# EAGLE design Spring12_6_Node (EAGLE 6.1)
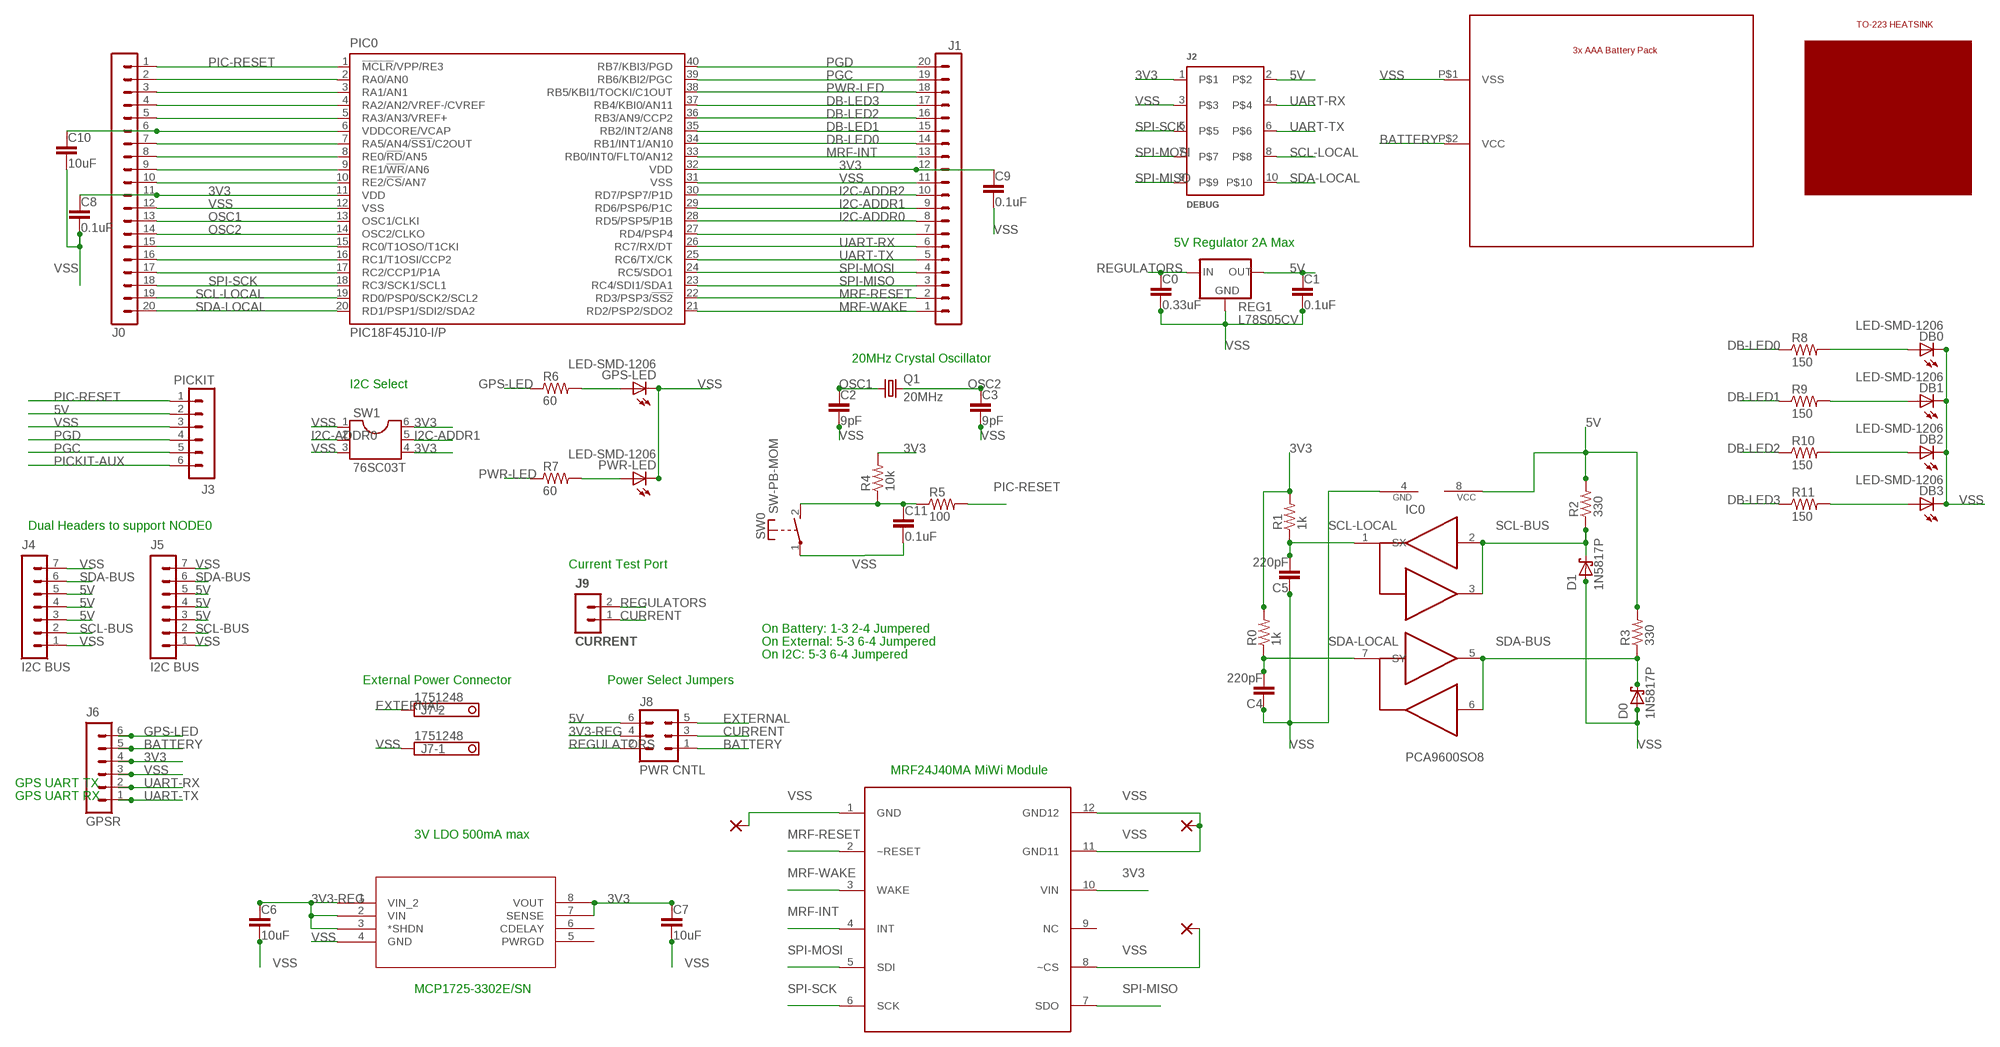
[diagram p0: schematic, sheet 1]

## Parts
BATT0  2479-BATTERY  [2479-BATTERY]
C0  0.33uF  C2.5-5  [C2.5-5]
C1  0.1uF  C2.5-5  [C2.5-5]
C2  9pF  C2.5-5  [C2.5-5]
C3  9pF  C2.5-5  [C2.5-5]
C4  220pF  C2.5-5  [C2.5-5]
C5  220pF  C2.5-5  [C2.5-5]
C6  10uF  C2.5-5  [C2.5-5]
C7  10uF  C2.5-5  [C2.5-5]
C8  0.1uF  C2.5-5  [C2.5-5]
C9  0.1uF  C2.5-5  [C2.5-5]
C10  10uF  C2.5-5  [C2.5-5]
C11  0.1uF  C2.5-5  [C2.5-5]
D0  1N5817P  [1N5817]
D1  1N5817P  [1N5817]
DB0  LED-SMD-1206  [LED1206]
DB1  LED-SMD-1206  [LED1206]
DB2  LED-SMD-1206  [LED1206]
DB3  LED-SMD-1206  [LED1206]
GPS-LED  LED-SMD-1206  [LED1206]
IC0  PCA9600SO8  [SO08]
J0  MA20-1  [MA20-1]
J1  MA20-1  [MA20-1]
J2  DEBUG  2510-6002  [2510-6002]
J3  PICKIT  MA06-1  [MA06-1]
J4  I2C BUS  MA07-1  [MA07-1]
J5  I2C BUS  MA07-1  [MA07-1]
J6  GPSR  MA06-1  [MA06-1]
J7  1751248  [1751248]
J8  PWR CNTL  MA03-2  [MA03-2]
J9  CURRENT  MA02-1  [MA02-1]
PIC0  PIC18F45J10-I/P  [DIL40]
PWR-LED  LED-SMD-1206  [LED1206]
Q1  20MHz  CRYSTALHC49U-V  [HC49U-V]
R0  1k  R-1/4W  [R-1/4W]
R1  1k  R-1/4W  [R-1/4W]
R2  330  R-1/4W  [R-1/4W]
R3  330  R-1/4W  [R-1/4W]
R4  10k  R1206  [R1206]
R5  100  R1206  [R1206]
R6  60  R1206  [R1206]
R7  60  R1206  [R1206]
R8  150  R1206  [R1206]
R9  150  R1206  [R1206]
R10  150  R1206  [R1206]
R11  150  R1206  [R1206]
REG0  MCP1725-XXXXX/SN  [SOIC8-N_MC]
REG1  L78S05CV  78XXL  [78XXL]
RF0  MRF24J40MA  [PCB12]
SW0  SW-PB-MOM  [SW-MOM-PB]
SW1  76SC03T  DIL6  [DIL06]
U$18  VIA  [VIA]
U$19  VIA  [VIA]
U$20  VIA  [VIA]
U$28  7-361-BA  [7-361-BA]

## Nets
3V3: C7.1 C8.1 C9.1 J0.11 J1.12 J2.1 J6.4 PIC0.11(VDD) PIC0.32(VDD) R0.2 R1.2 R4.2 REG0.7(SENSE) REG0.8(VOUT) RF0.10(VIN) SW1.4 SW1.6
3V3-REG: C6.1 J8.4 REG0.1(VIN_2) REG0.2(VIN) REG0.3(*SHDN)
5V: C1.1 IC0.8(VCC) J2.2 J3.2 J4.3 J4.4 J4.5 J5.3 J5.4 J5.5 J8.6 R2.2 R3.2 REG1.OUT
BATTERY: BATT0.P$2(VCC) J6.5 J8.1
CURRENT: J8.3 J9.1
DB-LED0: J1.14 PIC0.34(RB1/INT1/AN10) R8.1
DB-LED1: J1.15 PIC0.35(RB2/INT2/AN8) R9.1
DB-LED2: J1.16 PIC0.36(RB3/AN9/CCP2) R10.1
DB-LED3: J1.17 PIC0.37(RB4/KBI0/AN11) R11.1
EXTERNAL: J7.2 J8.5
GPS-LED: J6.6 R6.1
I2C-ADDR0: J1.8 PIC0.28(RD5/PSP5/P1B) SW1.2
I2C-ADDR1: J1.9 PIC0.29(RD6/PSP6/P1C) SW1.5
I2C-ADDR2: J1.10 PIC0.30(RD7/PSP7/P1D)
MRF-INT: J1.13 PIC0.33(RB0/INT0/FLT0/AN12) RF0.4(INT)
MRF-RESET: J1.2 PIC0.22(RD3/PSP3/!SS2!) RF0.2(~RESET)
MRF-WAKE: J1.1 PIC0.21(RD2/PSP2/SDO2) RF0.3(WAKE)
N$1: J0.8 PIC0.8(RE0/!RD!/AN5)
N$2: J0.15 PIC0.15(RC0/T1OSO/T1CKI)
N$3: J0.16 PIC0.16(RC1/T1OSI/CCP2)
N$4: GPS-LED.A R6.2
N$5: PWR-LED.A R7.2
N$6: C11.1 R4.1 R5.1 SW0.2(S)
N$7: DB0.A R8.2
N$8: J1.7 PIC0.27(RD4/PSP4)
N$9: DB1.A R9.2
N$10: DB2.A R10.2
N$11: DB3.A R11.2
N$13: J0.2 PIC0.2(RA0/AN0)
N$14: J0.3 PIC0.3(RA1/AN1)
N$15: J0.4 PIC0.4(RA2/AN2/VREF-/CVREF)
N$16: J0.5 PIC0.5(RA3/AN3/VREF+)
N$17: C10.1 J0.6 PIC0.6(VDDCORE/VCAP)
N$18: J0.7 PIC0.7(RA5/AN4/!SS1!/C2OUT)
N$20: J0.9 PIC0.9(RE1/!WR!/AN6)
N$21: J0.10 PIC0.10(RE2/!CS!/AN7)
N$26: J0.17 PIC0.17(RC2/CCP1/P1A)
OSC1: C2.1 J0.13 PIC0.13(OSC1/CLKI) Q1.1
OSC2: C3.1 J0.14 PIC0.14(OSC2/CLKO) Q1.2
PGC: J1.19 J3.5 PIC0.39(RB6/KBI2/PGC)
PGD: J1.20 J3.4 PIC0.40(RB7/KBI3/PGD)
PIC-RESET: J0.1 J3.1 PIC0.1(!MCLR!/VPP/RE3) R5.2
PICKIT-AUX: J3.6
PWR-LED: J1.18 PIC0.38(RB5/KBI1/TOCKI/C1OUT) R7.1
REGULATORS: C0.1 J8.2 J9.2 REG1.IN
SCL-BUS: D1.C IC0.2(RX) IC0.3(TX) J4.2 J5.2 R2.1
SCL-LOCAL: C5.2 IC0.1(SX) J0.19 J2.8 PIC0.19(RD0/PSP0/SCK2/SCL2) R1.1
SDA-BUS: D0.C IC0.5(TY) IC0.6(RY) J4.6 J5.6 R3.1
SDA-LOCAL: C4.2 IC0.7(SY) J0.20 J2.10 PIC0.20(RD1/PSP1/SDI2/SDA2) R0.1
SPI-MISO: J1.3 J2.9 PIC0.23(RC4/SDI1/SDA1) RF0.7(SDO)
SPI-MOSI: J1.4 J2.7 PIC0.24(RC5/SDO1) RF0.5(SDI)
SPI-SCK: J0.18 J2.5 PIC0.18(RC3/SCK1/SCL1) RF0.6(SCK)
UART-RX: J1.6 J2.4 J6.2 PIC0.26(RC7/RX/DT)
UART-TX: J1.5 J2.6 J6.1 PIC0.25(RC6/TX/CK)
VSS: BATT0.P$1(VSS) C0.2 C1.2 C2.2 C3.2 C4.1 C5.1 C6.2 C7.2 C8.2 C9.2 C10.2 C11.2 D0.A D1.A DB0.C DB1.C DB2.C DB3.C GPS-LED.C IC0.4(GND) J0.12 J1.11 J2.3 J3.3 J4.1 J4.7 J5.1 J5.7 J6.3 J7.1 PIC0.12(VSS) PIC0.31(VSS) PWR-LED.C REG0.4(GND) REG1.GND RF0.1(GND) RF0.8(~CS) RF0.11(GND11) RF0.12(GND12) SW0.1(P) SW1.1 SW1.3 U$18.1(P) U$19.1(P) U$20.1(P)
Unconnected: REG0.5(PWRGD) REG0.6(CDELAY) RF0.9(NC)

## Notes on the sheet
- 5V Regulator 2A Max
- 20MHz Crystal Oscillator
- I2C Select
- Dual Headers to support NODE0
- Current Test Port
- On Battery: 1-3 2-4 Jumpered
- On External: 5-3 6-4 Jumpered
- On I2C: 5-3 6-4 Jumpered
- External Power Connector | Power Select Jumpers
- MRF24J40MA MiWi Module
- GPS UART TX
- GPS UART RX
- 3V LDO 500mA max
- MCP1725-3302E/SN

## Library data of the parts
BATT0 = 4534_Node_Board:2479-BATTERY
C0 C1 C3-C7 = 4534_I2C2:C2.5-5: CAPACITOR, 2.5 MM SPACING
C2 C8-C11 = 4534_I2C2:C2.5-5: CAPACITOR, 2.5 MM SPACING; DIGIKEY: 490-3632-ND
D0 D1 = 4534_I2C2:1N5817: Schottky diode
DB0 DB1-DB3 GPS-LED PWR-LED = 4534_I2C2:LED-SMD-1206: 160-1169-1-ND
IC0 = 4534_I2C2:PCA9600: I2C ACTIVE TERMINATOR SO-8
J0 J1 = con-lstb:MA20-1: PIN HEADER; OC_FARNELL: unknown; OC_NEWARK: unknown
J2 = 4534_I2C2:2510-6002: 3M 2510-6002 Walled Header
J3 J6 = 4534:MA06-1: Male Header 0.040 drill
J4 J5 = 4534_I2C2:MA07-1: Male Header 0.040 drill
J7 = con-phoenix-350:1751248: MKDS 1/ 2-3,5 Printklemme Nennstrom: 10 A Bemessungsspannung: 160 V Raster: 3,5 mm Polzahl: 2 Montageart: Löten Anschlussart: Schraubanschluss Anschlussrichtung vom Leiter zur Platine: 0° Source: http://eshop.phoenixcontact.com .. 1751248.pdf; OC_FARNELL: unknown; OC_NEWARK: unknown
J8 = con-lstb:MA03-2: PIN HEADER; OC_FARNELL: unknown; OC_NEWARK: unknown
J9 = 4534_I2C2:MA02-1: Male Header 0.040 drill
PIC0 = 4534:PIC18F45J10: 40 PIN DIP PIC W/2 MSSP
Q1 = crystal:CRYSTAL: CRYSTAL; DIGIKEY: XC1723-ND; OC_FARNELL: 1666969; OC_NEWARK: unknown
R0 R1-R3 = 4534_I2C2:R-1/4W: STANDARD 1/4W 5% RESISTOR
R4-R11 = 4534_I2C2:R1206: Surface mount resistor, 1206 package
REG0 = 4534_Node_Board:MCP1725-XXXXX/SN; NEWARK: MCP1725-3002E/SN
REG1 = v-reg:78XXL: VOLTAGE REGULATOR
RF0 = 4534_Node_Board:MRF24J40MA
SW0 = 4534:SW-PB-MOM: Digi-Key P13589S-ND
SW1 = ic-package:DIL6: Dual In Line / Socket
U$18-U$20 = 4534_I2C2:VIA: connect top of board to bottom of board through a via
U$28 = 4534_Node_Board:7-361-BA

## Board
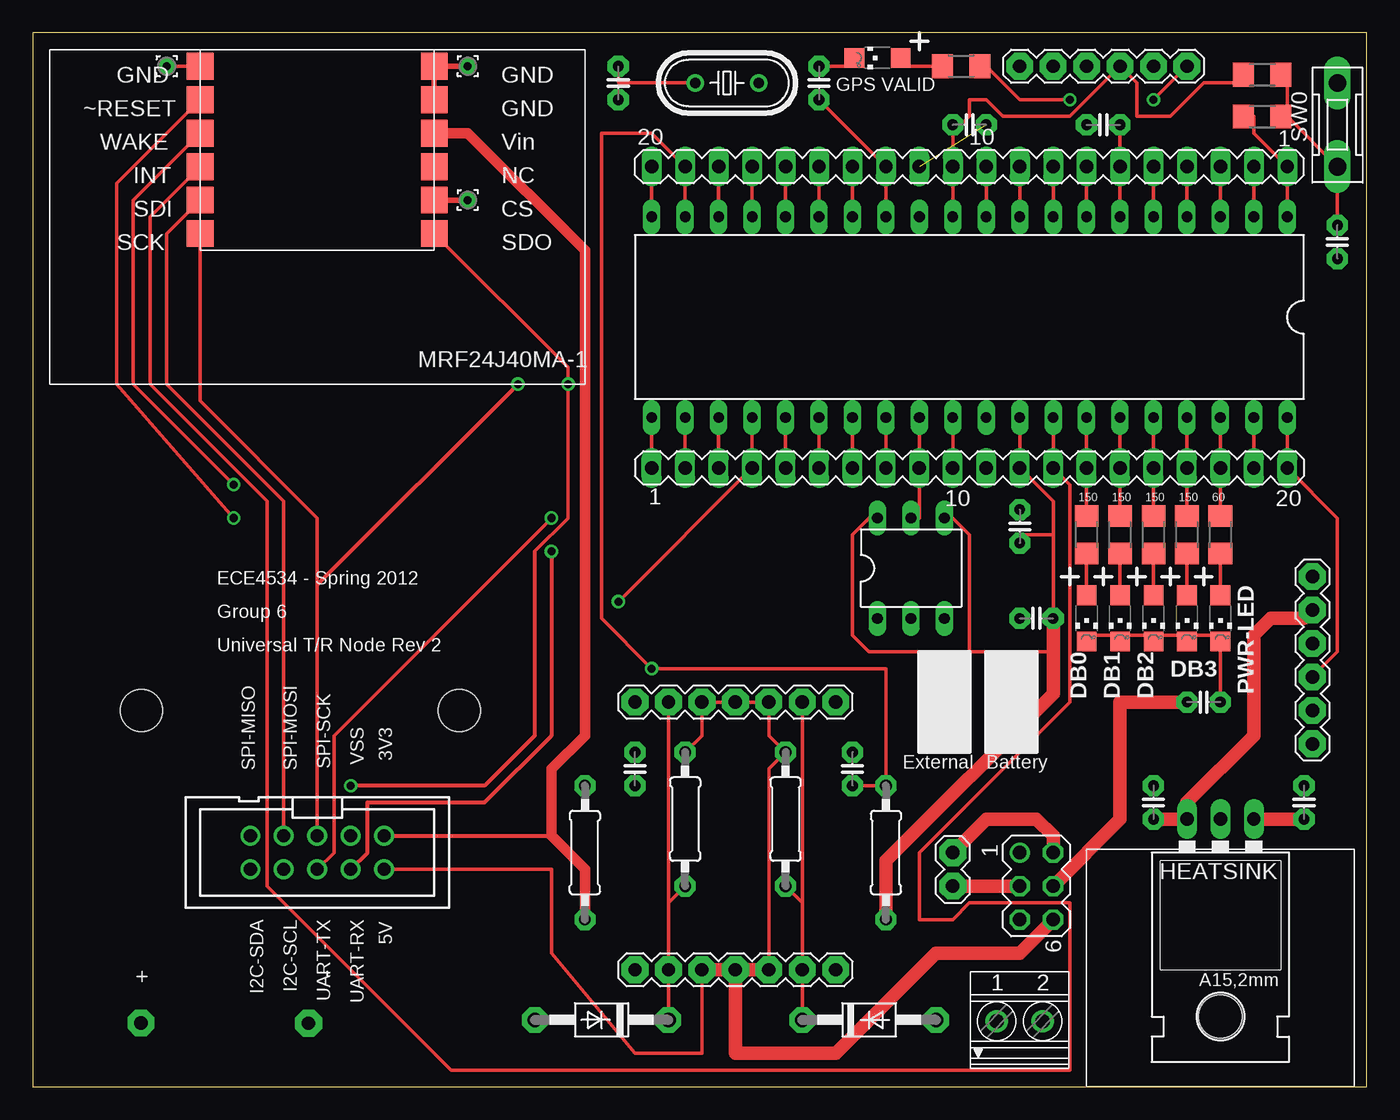
[diagram p1: board, top side]
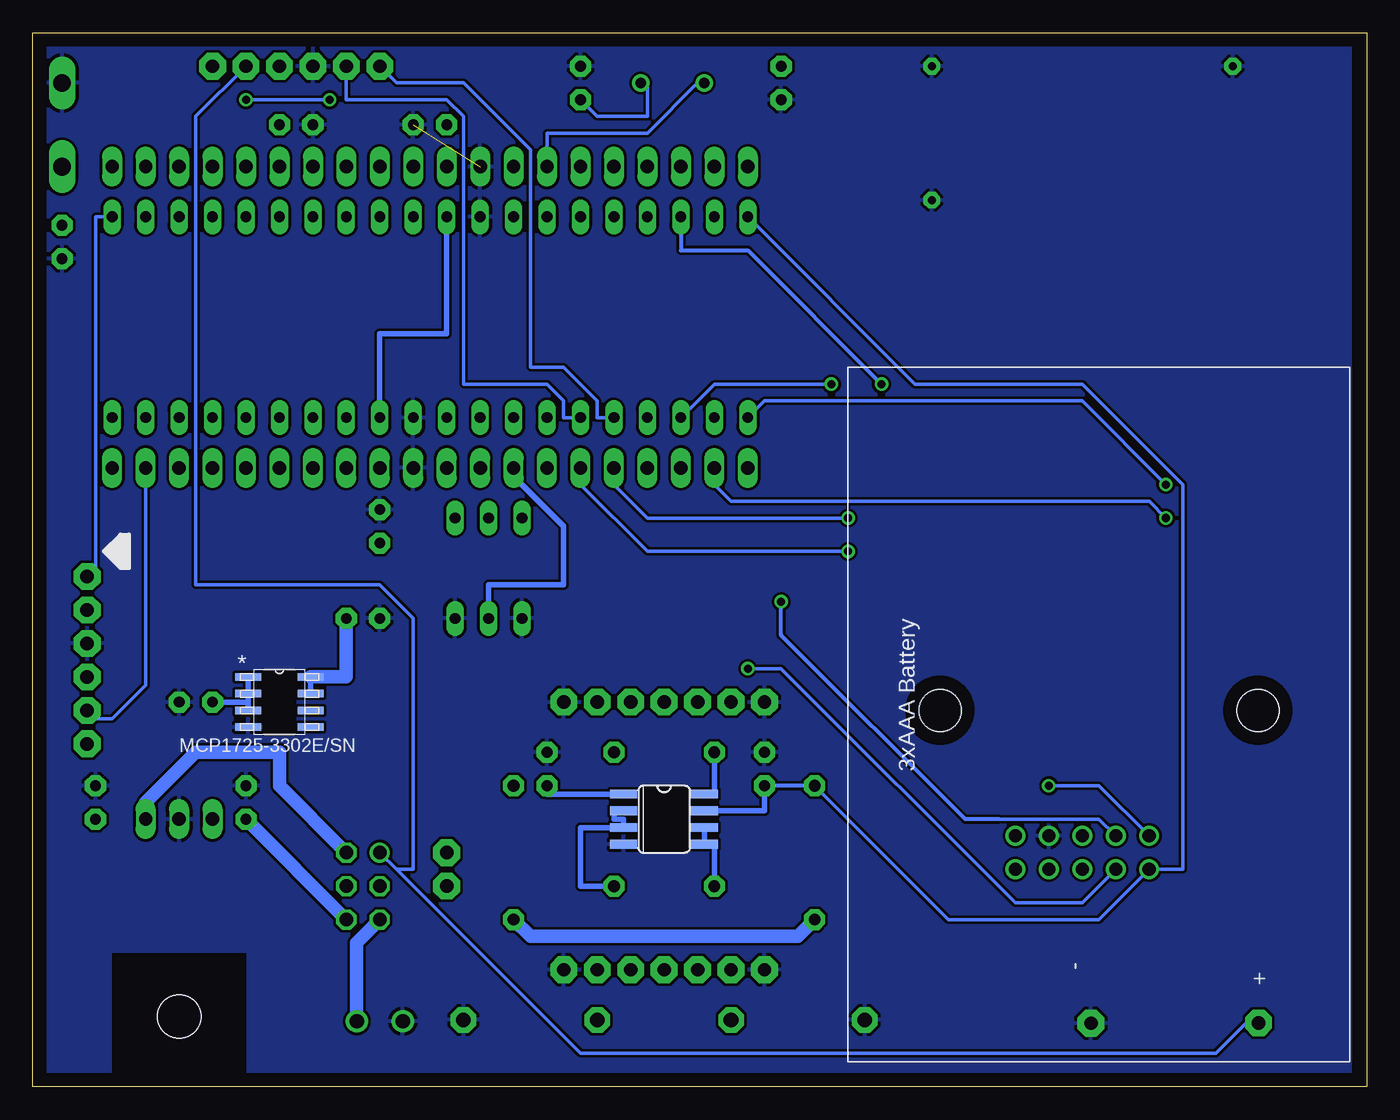
[diagram p2: board, bottom side, seen from below]

Size 101.27 x 80 mm. Coordinates in mm from the lower left corner, seen from the top.
Outline: 0,0 101.27,0 101.27,80 0,80 0,0
Copper layers (1*16): Top 0.035mm / dielectric 1.5mm / Bottom 0.035mm
Design rules: minimum track width 10mil, minimum drill 24mil, track to track 8mil, track to pad 8mil, pad to pad 8mil, via to via 8mil, smd to smd 8mil, copper to edge 40mil, drill to drill 8mil, minimum pad ring 10mil, minimum via ring 8mil, stop-mask expansion 4mil, vias tented up to drill 0mil, thermal gap 10mil
tRestrict: area 17.8,76.2 to 25.4,80; area 44.5,52.1 to 97.8,64.8; area 80,0 to 100.3,17.8; area 51.4,73.7 to 54,78.7; area 62.9,36.8 to 70.5,41.9; area 14,63.5 to 29.2,78.7
bRestrict: area 81.3,26.7 to 83.8,31.8; area 85.1,1.3 to 95.2,10.2; area 51.4,17.8 to 55.2,22.9
vRestrict: area 1.3,54.6 to 41.9,80; area 48.3,16.5 to 50.8,24.1; area 40.6,14 to 43.2,21.6; area 39.4,3.8 to 47,6.4; area 59.7,3.8 to 67.3,6.3; area 63.5,14 to 66,21.6; area 55.9,16.5 to 58.4,24.1; area 11.4,14 to 31.8,21.6

### Footprints (pad centres in the part's own frame; a part is rotated, then mirrored left to right if it is on the bottom)
2479-BATTERY = drill 1.016 pad 2.032 octagon: P$1 24.384,-7.01; P$2 24.359,-19.736 | hole 3.2: 0.635,4.445; 0.635,-19.685
C2.5-5 = drill 0.813 pad 1.6 octagon: 1 -1.27,0; 2 1.27,0
1N5817 = drill 1.118 pad 1.93 octagon: A 5.08,0; C -5.08,0
LED1206 = smd 1.5 x 1.5: A 0,-1.75; C 0,1.75
SO08 = smd 0.66 x 2.032: 1 -1.905,-3.073; 2 -0.635,-3.073; 3 0.635,-3.073; 4 1.905,-3.073; 5 1.905,3.073; 6 0.635,3.073; 7 -0.635,3.073; 8 -1.905,3.073
MA20-1 = drill 1.016 long: 1 -24.13,0; 2 -21.59,0; 3 -19.05,0; 4 -16.51,0; 5 -13.97,0; 6 -11.43,0; 7 -8.89,0; 8 -6.35,0; 9 -3.81,0; 10 -1.27,0; 11 1.27,0; 12 3.81,0; 13 6.35,0; 14 8.89,0; 15 11.43,0; 16 13.97,0; 17 16.51,0; 18 19.05,0; 19 21.59,0; 20 24.13,0
2510-6002 = drill 1 pad 1.422: 1 -5.08,-1.27; 2 -5.08,1.27; 3 -2.54,-1.27; 4 -2.54,1.27; 5 0,-1.27; 6 0,1.27; 7 2.54,-1.27; 8 2.54,1.27; 9 5.08,-1.27; 10 5.08,1.27
MA06-1 = drill 1.016 pad 2.032 octagon: 1 -6.35,0; 2 -3.81,0; 3 -1.27,0; 4 1.27,0; 5 3.81,0; 6 6.35,0
MA07-1 = drill 1.016 pad 2.032 octagon: 1 -7.62,0; 2 -5.08,0; 3 -2.54,0; 4 0,0; 5 2.54,0; 6 5.08,0; 7 7.62,0
1751248 = drill 1.1 pad 1.7: 1 -1.75,-0.1; 2 1.75,-0.1
MA03-2 = drill 1.016: 1 -2.54,-1.27 | drill 1.016 octagon: 2 -2.54,1.27; 3 0,-1.27; 4 0,1.27; 5 2.54,-1.27; 6 2.54,1.27
MA02-1 = drill 1.016 pad 2.032 octagon: 1 -1.27,0; 2 1.27,0
DIL40 = drill 0.813 long: 1 -24.13,-7.62; 2 -21.59,-7.62; 3 -19.05,-7.62; 4 -16.51,-7.62; 5 -13.97,-7.62; 6 -11.43,-7.62; 7 -8.89,-7.62; 8 -6.35,-7.62; 9 -3.81,-7.62; 10 -1.27,-7.62; 11 1.27,-7.62; 12 3.81,-7.62; 13 6.35,-7.62; 14 8.89,-7.62; 15 11.43,-7.62; 16 13.97,-7.62; 17 16.51,-7.62; 18 19.05,-7.62; 19 21.59,-7.62; 20 24.13,-7.62; 21 24.13,7.62; 22 21.59,7.62; 23 19.05,7.62; 24 16.51,7.62; 25 13.97,7.62; 26 11.43,7.62; 27 8.89,7.62; 28 6.35,7.62; 29 3.81,7.62; 30 1.27,7.62; 31 -1.27,7.62; 32 -3.81,7.62; 33 -6.35,7.62; 34 -8.89,7.62; 35 -11.43,7.62; 36 -13.97,7.62; 37 -16.51,7.62; 38 -19.05,7.62; 39 -21.59,7.62; 40 -24.13,7.62
HC49U-V = drill 0.813: 1 -2.413,0; 2 2.413,0
R-1/4W = drill 0.9 pad 1.6 octagon: 1 -5.08,0; 2 5.08,0
R1206 = smd 1.6 x 1.803: 1 -1.422,0; 2 1.422,0
SOIC8-N_MC = smd 1.981 x 0.559: 1 -2.362,1.905; 2 -2.362,0.635; 3 -2.362,-0.635; 4 -2.362,-1.905; 5 2.362,-1.905; 6 2.362,-0.635; 7 2.362,0.635; 8 2.362,1.905
78XXL = drill 1.016 long: GND 0,-3.81; IN -2.54,-3.81; OUT 2.54,-3.81 | hole 3.302: 0,11.176
PCB12 = smd 2.032 x 2.032: 1 -8.89,8.89; 2 -8.89,6.35; 3 -8.89,3.81; 4 -8.89,1.27; 5 -8.89,-1.27; 6 -8.89,-3.81; 7 8.89,-3.81; 8 8.89,-1.27; 9 8.89,1.27; 10 8.89,3.81; 11 8.89,6.35; 12 8.89,8.89
SW-MOM-PB = drill 1.346 long: 1 0,-3.81; 2 0,2.54
DIL06 = drill 0.813 long: 1 -2.54,-3.81; 2 0,-3.81; 3 2.54,-3.81; 4 2.54,3.81; 5 0,3.81; 6 -2.54,3.81
VIA = drill 0.61 pad 1.27 octagon: 1 0,0

### Placement (x,y rotation side)
BATT0  27.94,29.21 270 top
C0  96.52,21.59 90 top
C1  85.09,21.59 90 top
C2  59.69,76.2 90 top
C3  44.45,76.2 270 top
C4  45.72,24.13 270 top
C5  62.23,24.13 270 top
C6  88.9,29.21 0 top
C7  76.2,35.56 180 top
C8  74.93,42.55 90 top
C9  71.12,73.03 0 top
C10  81.28,73.03 180 top
C11  99.06,64.14 270 top
D0  43.18,5.08 180 top
D1  63.5,5.08 0 top
DB0  80.01,35.56 180 top
DB1  82.55,35.56 180 top
DB2  85.09,35.56 180 top
DB3  87.63,35.56 180 top
GPS-LED  64.14,78.11 90 top
IC0  53.34,20.32 270 bottom
J0  71.12,69.85 180 top
J1  71.12,46.99 0 top
J2  21.59,17.78 180 top
J3  97.16,32.38 270 top
J4  53.34,29.21 180 top
J5  53.34,8.89 180 top
J6  81.28,77.47 0 top
J7  74.93,5.08 0 top
J8  76.2,15.24 270 top
J9  69.85,16.51 90 top
PIC0  71.12,58.42 180 top
PWR-LED  90.17,35.56 180 top
Q1  52.7,76.2 180 top
R0  41.91,17.78 270 top
R1  64.77,17.78 270 top
R2  57.15,20.32 90 top
R3  49.53,20.32 90 top
R4  93.34,76.83 180 top
R5  93.34,73.66 180 top
R6  70.48,77.47 180 top
R7  90.17,41.91 270 top
R8  80.01,41.91 270 top
R9  82.55,41.91 270 top
R10  85.09,41.91 270 top
R11  87.63,41.91 270 top
REG0  82.55,29.21 0 bottom
REG1  90.17,16.51 180 top
RF0  21.59,68.58 0 top
SW0  99.06,72.39 180 top
SW1  66.67,39.37 0 top
U$18  33.02,67.31 0 top
U$19  33.02,77.47 0 top
U$20  10.16,77.47 0 top
U$28  87.63,2.54 180 top

### Tracks (layer width: path | path; a pad name or v marks a point on that pad's centre or on a via)
3V3
  Top 0.254: C7.1 77.47,41.91 | 77.47,41.91 77.47,44.45 J1.12 PIC0.32 | PIC0.11 J0.11 69.85,72.39 | 77.47,33.02 71.12,33.02 | 71.12,33.02 63.5,33.02 62.23,34.29 62.23,41.91 63.5,43.18 SW1.6 | 71.12,33.02 71.12,41.91 69.85,43.18 SW1.4 | 77.47,41.91 74.93,41.91 C8.1 | 69.85,73.66 C9.1 69.85,72.39 | R4.2 91.44,76.2 88.9,76.2 86.36,73.66 83.82,73.66 83.82,76.2 J6.4 78.74,73.66 73.66,73.66 72.39,74.93 71.12,74.93 71.12,73.66 69.85,72.39
  Top 0.305: J2.1 39.37,19.05
  Top 0.813: R0.2 41.91,16.51 39.37,19.05 39.37,24.13 41.91,26.67 41.91,63.5 33.02,72.39 RF0.10
  Top 1.016: R1.2 64.77,17.14 77.47,29.84 77.47,33.02 C7.1
  Bottom 0.406: REG0.7 REG0.8 | PIC0.32 74.93,57.15 69.85,57.15 PIC0.11
  Bottom 1.016: REG0.8 77.47,31.11 C7.1 | R0.2 43.18,11.43 63.5,11.43 R1.2
3V3-REG
  Top 1.016: J8.4 82.55,20.32 82.55,29.21 C6.1
  Bottom 0.406: REG0.1 REG0.2 | REG0.2 84.91,29.21 C6.1 | REG0.3 REG0.2
5V
  Top 0.254: R3.2 50.8,26.67 J4.5 J4.4 J4.3 55.88,26.67 R2.2 55.88,24.13 J5.3 | J2.2 39.37,16.51 39.37,10.16 45.72,2.54 50.8,2.54 J5.5 | 96.52,35.56 J3.2
  Top 1.016: J8.6 74.93,10.16 68.58,10.16 60.96,2.54 53.34,2.54 J5.4 | J5.5 J5.4 | J5.4 J5.3 | C1.1 REG1.OUT 87.63,21.59 92.71,26.67 92.71,34.29 93.98,35.56 96.52,35.56
  Bottom 0.406: IC0.8 49.53,22.23 R3.2
  Bottom 1.016: J8.6 C1.1
BATTERY
  Bottom 0.254: 73.66,16.51 59.69,2.54 11.43,2.54 8.89,5.08 BATT0.P$2 | 73.66,16.51 J8.1 | J6.5 88.9,73.66 88.9,38.1 74.93,38.1 72.39,35.56 72.39,16.51 73.66,16.51
CURRENT
  Top 1.016: J9.1 J8.3
DB-LED0
  Top 0.254: PIC0.34 J1.14 R8.1 80.01,43.18
DB-LED1
  Top 0.254: PIC0.35 J1.15 R9.1 82.55,43.18
DB-LED2
  Top 0.254: PIC0.36 J1.16 R10.1 85.09,43.18
DB-LED3
  Top 0.254: PIC0.37 J1.17 R11.1 87.63,43.18
EXTERNAL
  Bottom 1.016: J7.2 76.68,10.95 J8.5
GPS-LED  (via drill 0.61)
  Top 0.254: v78.74,74.93 74.93,74.93 72.39,77.47 R6.1 | J6.6 v85.09,74.93
  Bottom 0.254: v85.09,74.93 v78.74,74.93
I2C-ADDR0
  Top 0.254: J1.8 PIC0.28
  Bottom 0.406: SW1.2 66.67,38.1 60.96,38.1 60.96,42.55 64.77,46.35 J1.8
I2C-ADDR1
  Top 0.254: PIC0.29 J1.9 67.31,43.18 SW1.5
I2C-ADDR2
  Top 0.254: J1.10 PIC0.30
MRF-INT
  Top 0.254: PIC0.33 J1.13 78.74,45.72 78.74,29.21 67.31,17.78 67.31,12.7 69.85,12.7 71.12,13.97 78.74,13.97 78.74,1.27 31.75,1.27 17.78,15.24 17.78,44.45 8.89,53.34 8.89,66.04 RF0.4
MRF-RESET  (via drill 0.61)
  Top 0.254: RF0.2 6.35,68.58 6.35,53.34 v15.24,43.18 | J1.2 PIC0.22
  Bottom 0.254: v15.24,43.18 16.51,44.45 48.26,44.45 49.53,45.72 J1.2
MRF-WAKE  (via drill 0.61)
  Top 0.254: RF0.3 7.62,67.31 7.62,53.34 v15.24,45.72 | PIC0.21 J1.1
  Bottom 0.254: v15.24,45.72 21.59,52.07 45.72,52.07 PIC0.21
N$1
  Top 0.254: J0.8 PIC0.8
N$2
  Top 0.254: J0.15 PIC0.15
N$3
  Top 0.254: J0.16 PIC0.16
N$4
  Top 0.254: 66.04,78.74 GPS-LED.A 66.04,77.47 R6.2
N$5
  Top 0.254: 90.17,36.83 PWR-LED.A R7.2 90.17,40.64
N$6
  Top 0.254: 95.25,73.66 95.25,76.2 R4.1 | 95.25,73.66 SW0.2 C11.1 | 95.25,73.66 R5.1
N$7
  Top 0.254: 80.01,36.83 DB0.A R8.2 80.01,40.64
N$8
  Top 0.254: J1.7 PIC0.27
N$9
  Top 0.254: 82.55,36.83 DB1.A R9.2 82.55,40.64
N$10
  Top 0.254: 85.09,36.83 DB2.A R10.2 85.09,40.64
N$11
  Top 0.254: 87.63,36.83 DB3.A R11.2 87.63,40.64
N$13
  Top 0.254: J0.2 PIC0.2
N$14
  Top 0.254: J0.3 PIC0.3
N$15
  Top 0.254: J0.4 PIC0.4
N$16
  Top 0.254: J0.5 PIC0.5
N$17
  Top 0.254: PIC0.6 J0.6 C10.1
N$18
  Top 0.254: J0.7 PIC0.7
N$20
  Top 0.254: J0.9 PIC0.9
N$21
  Top 0.254: J0.10 PIC0.10
N$26
  Top 0.254: J0.17 PIC0.17
OSC1
  Top 0.254: PIC0.13 J0.13 C2.1
  Bottom 0.254: C2.1 58.42,73.66 54.61,73.66 54.61,76.2 Q1.1
OSC2
  Top 0.254: J0.14 PIC0.14 | C3.1 44.45,76.2 Q1.2 50.8,76.2
  Bottom 0.254: J0.14 62.23,72.39 54.61,72.39 50.8,76.2 Q1.2
PGC
  Top 0.254: J1.19 PIC0.39
  Bottom 0.254: J1.19 92.71,30.48 95.25,27.94 96.52,27.94 J3.5
PGD
  Top 0.254: PIC0.40 J1.20 99.06,43.18 99.06,33.02 J3.4
PIC-RESET
  Top 0.254: PIC0.1 J0.1 92.71,72.39 92.71,73.66 R5.2
  Bottom 0.254: PIC0.1 96.52,66.04 96.52,39.37 J3.1
PWR-LED
  Top 0.254: PIC0.38 J1.18 R7.1 90.17,43.18
REGULATORS
  Top 1.016: C0.1 REG1.IN | J9.2 72.39,20.32 76.2,20.32 77.47,19.05 J8.2
  Bottom 1.016: J8.2 82.55,22.86 82.55,25.4 88.9,25.4 92.71,21.59 REG1.IN
SCL-BUS
  Top 0.254: 58.42,13.97 R2.1 | 58.42,13.97 J5.2 D1.C | 58.42,13.97 J4.2
  Bottom 0.406: IC0.2 57.15,20.95 57.15,20.32 56.41,20.32 IC0.3 59.69,19.68 59.69,15.24 R2.1
SCL-LOCAL  (via drill 0.61)
  Top 0.254: C5.2 R1.1 64.77,31.75 v46.99,31.75 43.18,35.56 43.18,72.39 46.99,72.39 J0.19 PIC0.19
  Bottom 0.254: J2.8 21.59,13.97 26.67,13.97 44.45,31.75 v46.99,31.75
  Bottom 0.406: IC0.1 62.23,22.23 C5.2
SDA-BUS
  Top 0.254: 48.26,13.97 R3.1 | 48.26,13.97 J5.6 D0.C | 48.26,13.97 J4.6
  Bottom 0.406: IC0.6 IC0.5 49.53,18.41 R3.1
SDA-LOCAL
  Top 0.254: PIC0.20 J0.20
  Bottom 0.254: R0.1 31.75,12.7 20.32,12.7 J2.10 13.97,16.51 13.97,45.72 21.59,53.34 34.29,53.34 PIC0.20
  Bottom 0.305: R0.1 C4.2
  Bottom 0.406: IC0.7 45.72,20.95 C4.2
SPI-MISO  (via drill 0.61)
  Top 0.254: RF0.7 40.64,54.61 v40.64,53.34 40.64,43.18 38.1,40.64 | PIC0.23 J1.3
  Top 0.305: 38.1,40.64 38.1,26.67 34.29,22.86 v24.13,22.86
  Bottom 0.254: v40.64,53.34 49.53,53.34 PIC0.23 | J2.9 20.32,22.86 v24.13,22.86
SPI-MOSI  (via drill 0.61)
  Top 0.254: PIC0.24 J1.4 v44.45,36.83 | RF0.5 10.16,64.77 10.16,53.34 19.05,44.45 J2.7
  Bottom 0.254: 27.94,20.32 20.32,20.32 J2.7
  Bottom 0.305: 27.94,20.32 30.48,20.32 44.45,34.29 v44.45,36.83
SPI-SCK  (via drill 0.61)
  Top 0.254: RF0.6 12.7,52.07 21.59,43.18 21.59,38.1 J2.5 | PIC0.18 J0.18
  Top 0.305: v36.83,53.34 21.59,38.1
  Bottom 0.305: PIC0.18 52.07,63.5 46.99,63.5 v36.83,53.34
UART-RX  (via drill 0.61)
  Top 0.254: PIC0.26 J1.6
  Top 0.305: v39.37,40.64 39.37,26.67 34.29,21.59 25.4,21.59 25.4,17.78 J2.4
  Bottom 0.254: v39.37,40.64 54.61,40.64 59.69,45.72 J1.6 | J6.2 77.47,74.93 69.85,74.93 68.58,73.66 68.58,53.34 62.23,53.34 60.96,52.07 60.96,50.8 PIC0.26
UART-TX  (via drill 0.61)
  Top 0.254: J2.6 22.86,17.78 22.86,26.67 v39.37,43.18 | PIC0.25 J1.5
  Bottom 0.254: v39.37,43.18 54.61,43.18 57.15,45.72 J1.5 | J6.1 73.66,76.2 68.58,76.2 63.5,71.12 63.5,54.61 60.96,54.61 58.42,52.07 58.42,50.8 PIC0.25
VSS  (1 unrouted)
  Top 0.254: U$20.1 RF0.1 | 82.55,34.29 80.01,34.29 DB0.C | 82.55,34.29 85.09,34.29 | 82.55,34.29 DB1.C | 85.09,34.29 87.63,34.29 | 85.09,34.29 DB2.C | 87.63,34.29 90.17,34.29 PWR-LED.C C6.2 | 87.63,34.29 DB3.C | C2.2 62.23,77.47 GPS-LED.C
  Top 0.406: U$19.1 RF0.12 RF0.11 | RF0.8 U$18.1
  pour Bottom: 1.27,80.01 1.27,0 100.33,0 100.33,80.01

### Text on the board
tPlace: ECE4534 - Spring 2012 | Group 6 | Universal T/R Node Rev 2 | External | Battery
tNames: GPS VALID | 150 | 150 | 150 | 150 | 60 | SPI-MISO | SPI-MOSI | SPI-SCK | VSS | 3V3 | I2C-SDA | I2C-SCL | UART-TX | UART-RX | 5V
bNames: MCP1725-3302E/SN